# EAGLE design control (EAGLE 8.4.2)
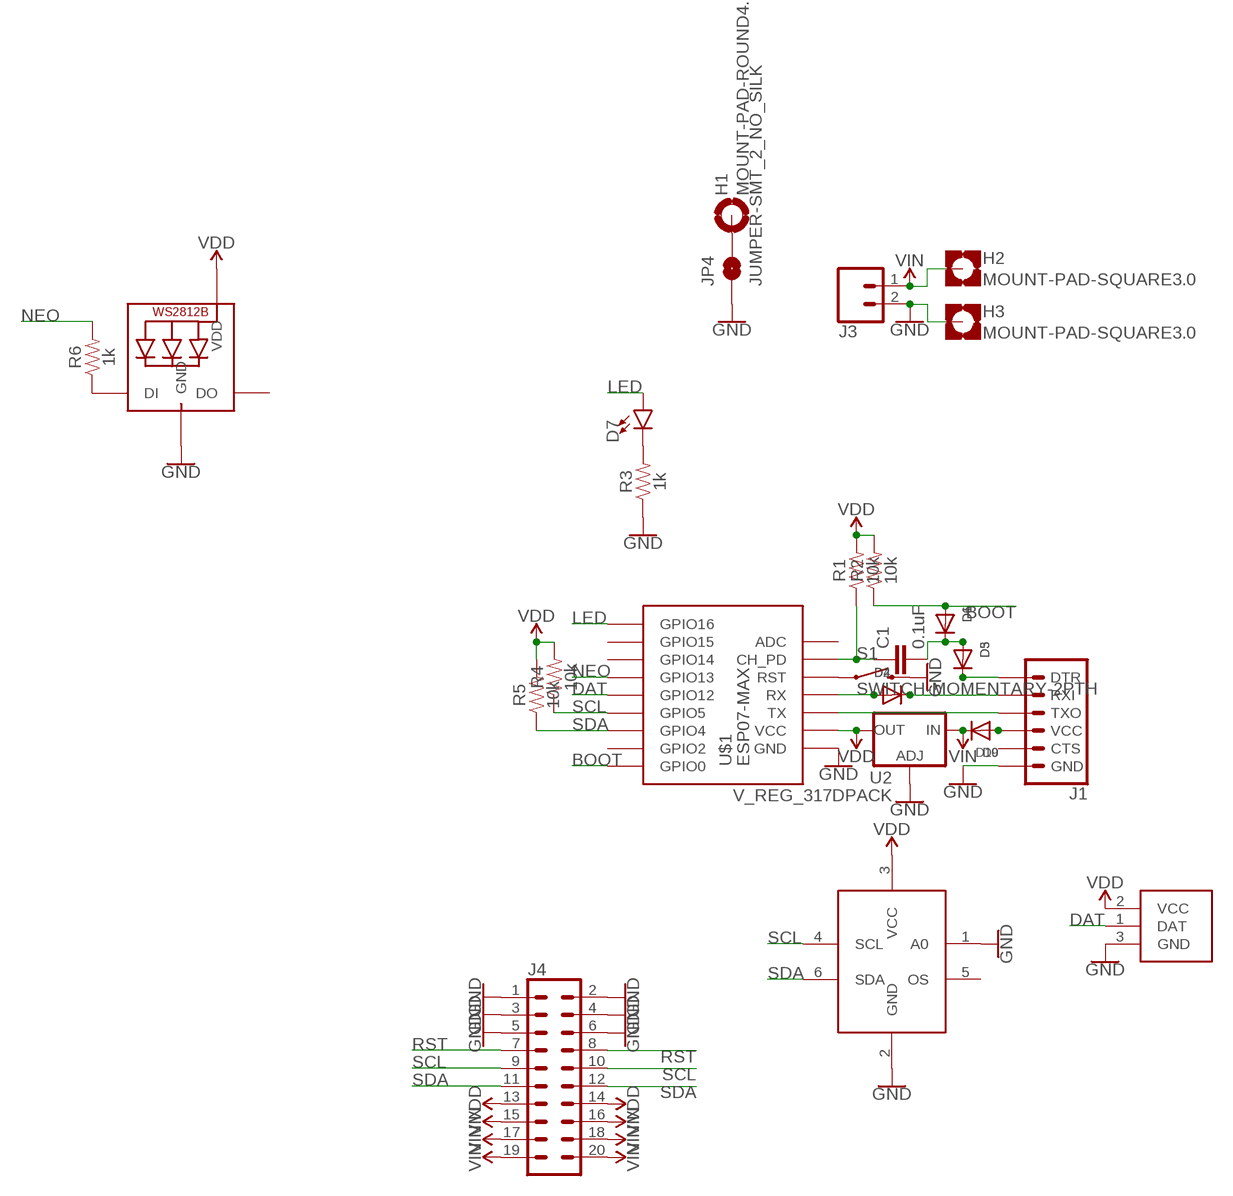
[diagram p0: schematic, sheet 1]

## Parts
C1  0.1uF  0.1UF-0603-25V-5%  [0603]
D1  DIODESOD-123  [SOD-123]
D2  DIODESOD-123  [SOD-123]
D3  DIODESOD-123  [SOD-123]
D4  DIODE_SOD-123FL  [SOD-123FL]
D5  DIODE_SOD-123FL  [SOD-123FL]
D6  DIODE_SOD-123FL  [SOD-123FL]
D7  LED0603  [LED-0603]
D9  DIODESOD-123  [SOD-123]
D10  DIODE_SOD-123FL  [SOD-123FL]
H1  MOUNT-PAD-ROUND4.1  [4,1-PAD]
H2  MOUNT-PAD-SQUARE3.0  [3,0-PAD-SQUARE]
H3  MOUNT-PAD-SQUARE3.0  [3,0-PAD-SQUARE]
J1  6_PIN_SERIAL_TARGETSILK  [6_PIN_SERIAL_TARGET_SIDE_W_SILK]
J3  CONN_025MM  [SCREWTERMINAL-5MM-2]
J4  CONN_10X2  [2X10]
JP4  JUMPER-SMT_2_NO_SILK  [SMT-JUMPER_2_NO_SILK]
LED1  WS2812BCOMBO  [COMBONEO]
R1  10k  10KOHM-0603-1/10W-1%  [0603]
R2  10k  10KOHM-0603-1/10W-1%  [0603]
R3  1k  1KOHM-0603-1/10W-1%  [0603]
R4  10k  10KOHM-0603-1/10W-1%  [0603]
R5  10k  10KOHM-0603-1/10W-1%  [0603]
R6  1k  1KOHM-0603-1/10W-1%  [0603]
S1  SWITCH-MOMENTARY-2PTH  [TACTILE-PTH]
U2  V_REG_317DPACK  [V-REG_DPACK]
U$1  ESP07-MAX  [ESP07-MAX]
U$2  PCT2075GV  [SOT23-6]
U$3  ATSHA204A  [SOT23]

## Nets
BOOT: D1.A D6.A R2.1 U$1.P11(GPIO0)
DAT: U$1.P05(GPIO12) U$3.1(DAT)
GND: H3.B3,0(MOUNT) J1.P$6(GND) J3.2 J4.1 J4.2 J4.3 J4.4 J4.5 J4.6 JP4.1 LED1.VSS1(GND) LED1.VSS2(GND) R3.1 S1.3 S1.4 U2.1(ADJ) U$1.P08(GND) U$2.1(A0) U$2.2(GND) U$3.3(GND)
LED: D7.A U$1.P03(GPIO16)
N$1: H1.B4,1(MOUNT) JP4.2
N$2: C1.1 R1.1 U$1.P02(CH_PD)
N$3: D2.A D4.A U$1.P14(RX)
N$4: J1.P$2(TXO) U$1.P15(TX)
N$5: S1.1 S1.2 U$1.P00(RST)
N$6: LED1.DIN1(DI) LED1.DIN2(DI) R6.1
N$7: D2.C D4.C J1.P$3(RXI)
N$8: D3.C D5.C J1.P$1(DTR)
N$9: D7.C R3.2
N$10: D9.A D10.A J1.P$4(VCC)
N$17: C1.2 D1.C D3.A D5.A D6.C
NEO: R6.2 U$1.P06(GPIO13)
RST: J4.7 J4.8
SCL: J4.9 J4.10 R4.1 U$1.P12(GPIO5) U$2.4(SCL)
SDA: J4.11 J4.12 R5.1 U$1.P13(GPIO4) U$2.6(SDA)
VDD: J4.13 J4.14 LED1.VDD1(VDD) LED1.VDD2(VDD) R1.2 R2.2 R4.2 R5.2 U2.4(OUT) U$1.P07(VCC) U$2.3(VCC) U$3.2(VCC)
VIN: D9.C D10.C H2.B3,0(MOUNT) J3.1 J4.15 J4.16 J4.17 J4.18 J4.19 J4.20 U2.3(IN)
Unconnected: J1.P$5(CTS) LED1.DOUT1(DO) LED1.DOUT2(DO) U$1.P01(ADC) U$1.P04(GPIO14) U$1.P09(GPIO15) U$1.P10(GPIO2) U$2.5(OS)

## Library data of the parts
C1 = SparkFun-Capacitors:0.1UF: 0.1µF ceramic capacitors A capacitor is a passive two-terminal electrical component used to store electrical energy temporarily in an electric field.; PROD_ID: CAP-08604
D1-D6 D9 D10 = adafruit:DIODE: Diode SMADIODE - SMA Surface Mount Package 20V 1A Schottky Diode Digikey: 641-1014-6-ND DO-1N4148 - Through Hole Small Current Diode SOD-123 20V 1 A (.5mV Vf) Schottky Diode - Digikey: MBRX120TPMSCT-ND SOD-323 10V 570mA (.38mV Vf, 3ns) Schottky Diode - Digikey: ZLLS410CT-ND SOD-523 30V 30mA Schottky Diode (RB751S-40TE61) - Digikey: RB751S-40TE61CT-ND SOT23-R/W - SOT23 Package (R = Solder Paste/Reflow Ovens, W = Hand-Soldering) BAT54Film 40V 300mA - Digikey: 497-7162-1-ND
D7 = SparkFun-LED:LED: LED (Generic) Standard schematic elements and footprints for 5mm, 3mm, 1206, and 0603 sized LEDs. Generic LEDs with no color specified.
H1 = holes:MOUNT-PAD-ROUND: MOUNTING PAD, round
H2 H3 = holes:MOUNT-PAD-SQUARE: MOUNTING PAD, square
J1 = SparkFun-Connectors:6_PIN_SERIAL_TARGET: 6-pin header connection for use with the "FTDI BASIC" pinout - TARGET SIDE. Also known as "Arduino Serial Program Header". It is used to mate with our FTDI Basic serial programmers using the Arduino IDE. Note, this device has "TARGET" in the name. It is intended to be used on a design that contains a target micro-controller that you wish to program. The "sister" device, named "CABLE" is inteneded to be used on a design that usually lives on the end of your USB cable and prvides the converter chip (FTDI232 or FTDI231x) to commnicate serial RX/TX. You can populate with some of these: Break Away Headers - Straight <https://www.sparkfun.com/products/116> (PRT-00116) For reference (or to suit your programming needs) check out these designs: SparkFun FTDI Basic Breakout - 5V <https://www.sparkfun.com/products/9716> (DEV-09716) SparkFun FTDI Basic Breakout - 3.3V <https://www.sparkfun.com/products/9873> (DEV-09873) SparkFun FTDI SmartBasic <https://www.sparkfun.com/products/12935> (DEV-12935) SparkFun Beefy 3 - FTDI Basic Breakout <https://www.sparkfun.com/products/13746> (DEV-13746)
J3 = SparkFun-Connectors:CONN_02: Multi connection point. Often used as Generic Header-pin footprint for 0.1 inch spaced/style header connections On any of the 0.1 inch spaced packages, you can populate with these: Break Away Headers - Straight <https://www.sparkfun.com/products/116> (PRT-00116) Break Away Male Headers - Right Angle <https://www.sparkfun.com/products/553> (PRT-00553) Female Headers <https://www.sparkfun.com/products/115> (PRT-00115) Break Away Headers - Machine Pin <https://www.sparkfun.com/products/117> (PRT-00117) Break Away Female Headers - Swiss Machine Pin <https://www.sparkfun.com/products/743> (PRT-00743) For SCREWTERMINALS and SPRING TERMINALS visit here: Screw Terimnals on SparkFun.com <https://www.sparkfun.com/search/results?term=Screw+Terminals> (5mm/3.5mm/2.54mm spacing) This device is also useful as a general connection point to wire up your design to another part of your project. Our various solder wires solder well into these plated through hole pads. Hook-Up Wire - Assortment (Stranded, 22 AWG) <https://www.sparkfun.com/products/11375> (PRT-11375) Hook-Up Wire - Assortment (Solid Core, 22 AWG) <https://www.sparkfun.com/products/11367> (PRT-11367) View the entire wire category on our website here <https://www.sparkfun.com/categories/141> Special notes: Molex polarized connector foot print use with: PRT-08233 with associated crimp pins and housings. 2.54_SCREWTERM for use with PRT-10571. 3.5mm Screw Terminal footprints for PRT-08084 5mm Screw Terminal footprints for use with PRT-08432; SF_SKU: PRT-08432
J4 = SparkFun-Connectors:CONN_10X2: Multi connection point. Often used as Generic Header-pin footprint for 0.1 inch spaced/style header connections On any of the 0.1 inch spaced packages, you can populate with these: Break Away Headers - Straight <https://www.sparkfun.com/products/116> (PRT-00116) Break Away Male Headers - Right Angle <https://www.sparkfun.com/products/553> (PRT-00553) Female Headers <https://www.sparkfun.com/products/115> (PRT-00115) Break Away Headers - Machine Pin <https://www.sparkfun.com/products/117> (PRT-00117) Break Away Female Headers - Swiss Machine Pin <https://www.sparkfun.com/products/743> (PRT-00743) Special note about the "SPECIAL" package: This was SPECIALLY designed to be used with our Graphic LCD Backpack. Be sure you want to use this! It is not only staggered on each line of header holes, but IT IS ALSO offset of the center point of the top and bottom lines by 5 mil. This causes the headers to lock into place on the "standard" footprint on the LCD screen. The extra squares on the tdocu layer are there simply to reference other pins (if you were to actually populate a longer header than ten long - this is what we do with the backpacks).
JP4 = SparkFun-Jumpers:JUMPER-SMT_2_NO: Normally open jumper This jumper has two pads in close proximity to each other. Apply solder to close the connection. Round pads are easier to solder for beginners, but are a lot larger. SparkFun Product that uses the round pads: SparkFun EL Sequencer <https://www.sparkfun.com/products/12781>
LED1 = maxorig:WS2812B
R1 R2 R4 R5 = SparkFun-Resistors:10KOHM: 10kΩ resistor A resistor is a passive two-terminal electrical component that implements electrical resistance as a circuit element. Resistors act to reduce current flow, and, at the same time, act to lower voltage levels within circuits. - Wikipedia; PROD_ID: RES-00824
R3 R6 = SparkFun-Resistors:1KOHM: 1kΩ resistor A resistor is a passive two-terminal electrical component that implements electrical resistance as a circuit element. Resistors act to reduce current flow, and, at the same time, act to lower voltage levels within circuits. - Wikipedia; PROD_ID: RES-07856
S1 = maxorig:SWITCH-MOMENTARY-2: Various NO switches- pushbuttons, reed, etc; PROD_ID: SWCH-08441
U2 = SparkFun-IC-Power:V_REG_317: Voltage Regulator Standard LM317 adjustable voltage regulator. AOI (Adjust Output Input). Google 'LM317 Calculator' for easy to use app to get the two resistor values needed. 240/720 for 5V output. 240/390 for 3.3V output. Spark Fun Electronics SKU : COM-00527; PROD_ID: IC-09888
U$1 = esp8266modules:ESP07-MAX: ESP8266 Wifi module 07 & 08
U$2 = maxorig:PCT2075GV: I2C bus digital temperature sensor and thermal watchdog 2.7-5.5V supply, -55 to +125 C range, 11-bit ADC Can be used as a simple thermostat, pulls OS pin low or high when a high temp is reached, and returns to original state when temp reaches low setpoint. Three devices can be used on the same bus due to unique tri-state address pin, non-TSOP6 versions have 3 address pins for 27 possible addresses.
U$3 = maxorig:ATSHA204A

## Board
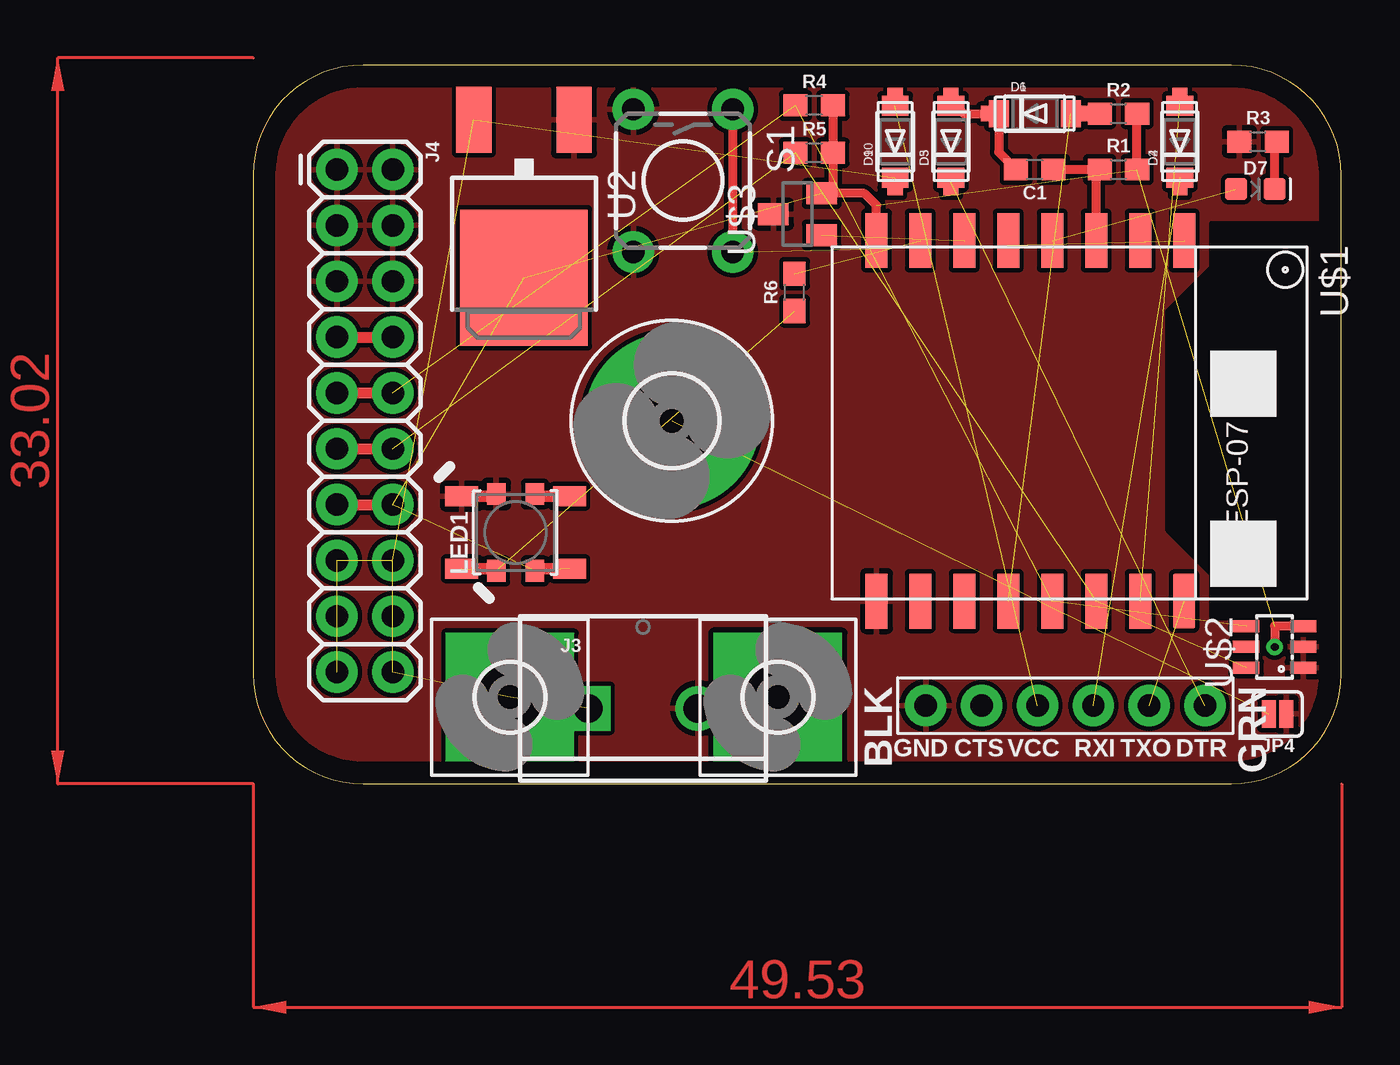
[diagram p1: board, top side]
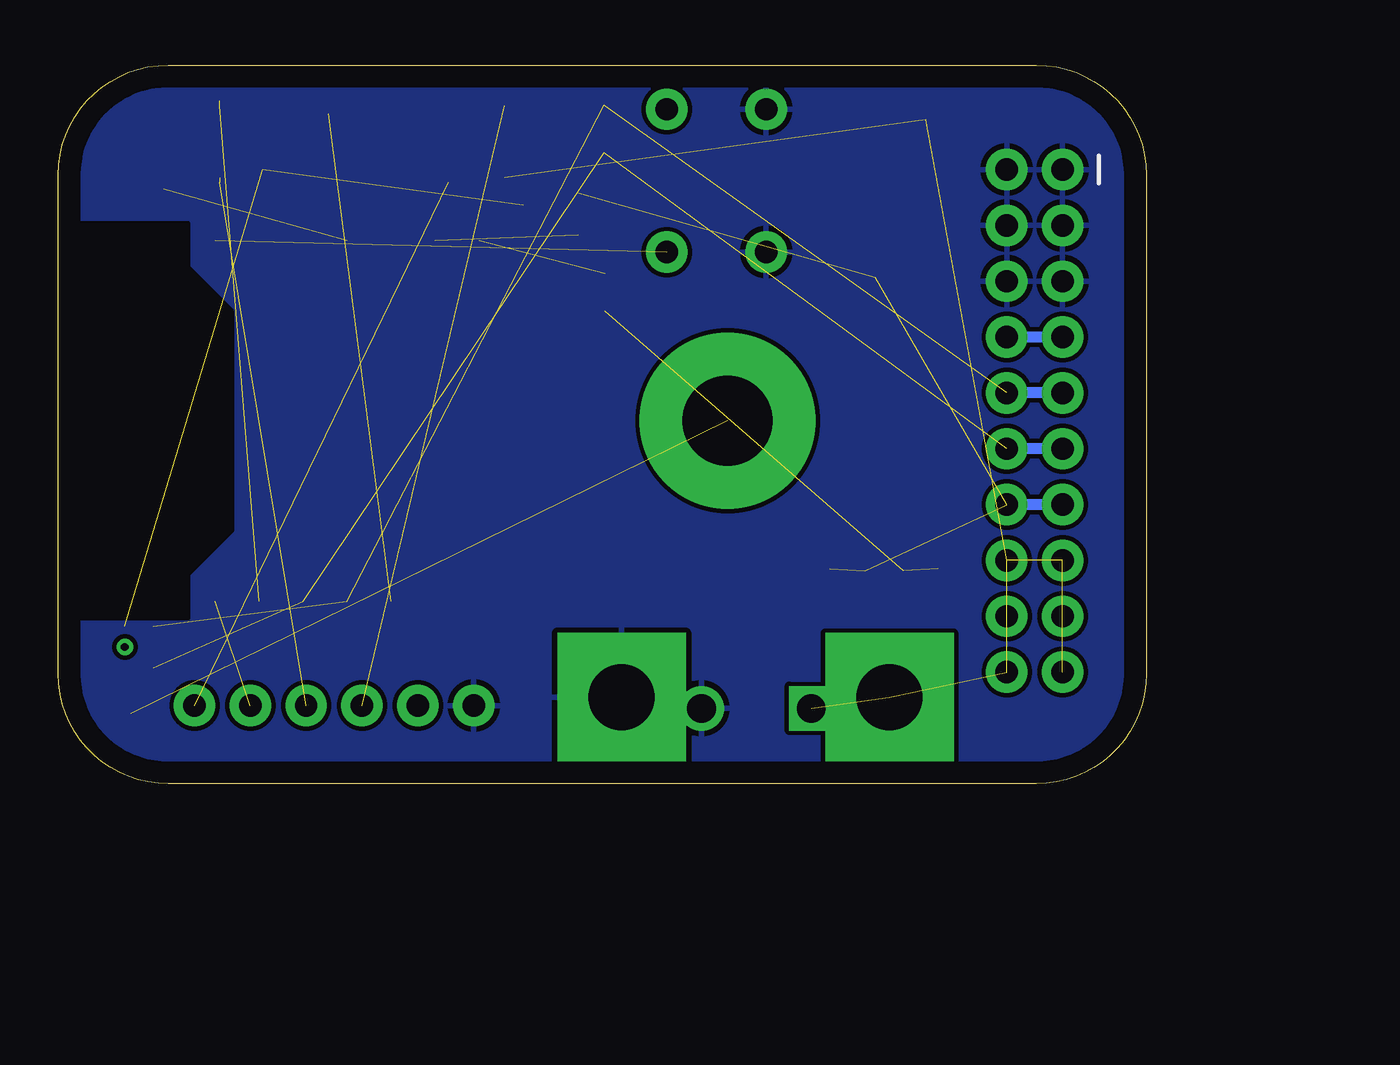
[diagram p2: board, bottom side, seen from below]

Size 49.51 x 32.69 mm. Coordinates in mm from the lower left corner, seen from the top.
Outline: 0,27.69 0,5 arc90 5,0 44.51,0 arc90 49.51,5 49.51,27.69 arc90 44.51,32.69 5,32.69 arc90 0,27.69
Copper layers (1*16): Top 0.035mm / dielectric 1.5mm / Bottom 0.035mm
Design rules "default": minimum track width 10mil, minimum drill 24mil, track to track 8mil, track to pad 8mil, pad to pad 8mil, via to via 8mil, smd to smd 8mil, copper to edge 40mil, drill to drill 8mil, minimum pad ring 10mil, minimum via ring 8mil, stop-mask expansion 4mil, vias tented up to drill 0mil, thermal gap 10mil

### Footprints (pad centres in the part's own frame; a part is rotated, then mirrored left to right if it is on the bottom)
0603 = smd 1.1 x 1: 1 -0.85,0; 2 0.85,0
SOD-123 = smd 1.2 x 0.7: A 1.85,0; C -1.85,0
SOD-123FL = smd 0.91 x 1.22: A 1.637,0; C -1.637,0
LED-0603 = smd 1 x 1: A -0.877,0; C 0.877,0
4,1-PAD = drill 4.1 pad 8: B4,1 0,0
3,0-PAD-SQUARE = drill 3 pad 5.842 square: B3,0 0,0
6_PIN_SERIAL_TARGET_SIDE_W_SILK = drill 1.016 pad 1.88: P$1 -6.35,0; P$2 -3.81,0; P$3 -1.27,0; P$4 1.27,0; P$5 3.81,0; P$6 6.35,0
SCREWTERMINAL-5MM-2 = drill 1.3 pad 2.032 square: 1 0,0 | drill 1.3 pad 2.032: 2 5,0
2X10 = drill 1.016 pad 1.88: 1 0,0; 2 0,2.54; 3 2.54,0; 4 2.54,2.54; 5 5.08,0; 6 5.08,2.54; 7 7.62,0; 8 7.62,2.54; 9 10.16,0; 10 10.16,2.54; 11 12.7,0; 12 12.7,2.54; 13 15.24,0; 14 15.24,2.54; 15 17.78,0; 16 17.78,2.54; 17 20.32,0; 18 20.32,2.54; 19 22.86,0; 20 22.86,2.54
SMT-JUMPER_2_NO_SILK = smd 0.635 x 1.27: 1 -0.406,0; 2 0.406,0
COMBONEO = smd 1 x 0.85: DIN1 -1.75,0.875; DOUT1 1.75,-0.875; VDD1 -1.75,-0.875; VSS1 1.75,0.875 | smd 0.9 x 1.5: DIN2 -1.65,2.45; DOUT2 1.65,-2.45; VDD2 -1.65,-2.45; VSS2 1.65,2.45
TACTILE-PTH = drill 1.016 pad 1.88: 1 -3.251,2.261; 2 3.251,2.261; 3 -3.251,-2.261; 4 3.251,-2.261
V-REG_DPACK = smd 1.6 x 3: 1 -2.28,-4.8; 3 2.28,-4.8 | smd 5.8 x 6.2: 4 0,2.38
ESP07-MAX = smd 2.5 x 1: P00 -8.2,6.8; P01 -8.2,4.8; P02 -8.2,2.8; P03 -8.2,0.8; P04 -8.2,-1.2; P05 -8.2,-3.2; P06 -8.2,-5.2; P07 -8.2,-7.2; P08 8.2,-7.2; P09 8.2,-5.2; P10 8.2,-3.2; P11 8.2,-1.2; P12 8.2,0.8; P13 8.2,2.8; P14 8.2,4.8; P15 8.2,6.8
SOT23-6 = smd 0.55 x 1.2: 1 -0.95,-1.3; 2 0,-1.3; 3 0.95,-1.3; 4 0.95,1.3; 5 0,1.3; 6 -0.95,1.3
SOT23 = smd 1 x 1.4: 1 -0.95,-1.1; 2 0.95,-1.1; 3 0,1.1

### Placement (x,y rotation side)
C1  35.56,27.94 180 top
D1  35.56,30.48 0 top
D2  42.16,29.21 90 top
D3  31.75,29.21 90 top
D4  42.16,29.21 90 top
D5  31.75,29.21 90 top
D6  35.56,30.48 0 top
D7  45.59,27.05 0 top
D9  29.21,29.21 90 top
D10  29.21,29.21 90 top
H1  19.05,16.51 0 top
H2  11.68,3.94 0 top
H3  23.88,3.94 0 top
J1  36.96,3.56 180 top
J3  15.24,3.43 0 top
J4  3.81,27.94 270 top
JP4  46.61,3.17 180 top
LED1  11.94,11.43 90 top
R1  39.37,27.94 0 top
R2  39.37,30.48 0 top
R3  45.72,29.21 0 top
R4  25.53,30.86 0 top
R5  25.53,28.7 0 top
R6  24.64,22.35 90 top
S1  19.56,27.43 270 top
U2  12.32,25.4 180 top
U$1  35.56,16.51 270 top
U$2  46.48,6.22 90 top
U$3  24.77,25.91 90 top

### Tracks (layer width: path | path; a pad name or v marks a point on that pad's centre or on a via)
BOOT  (1 unrouted)
  Top 0.406: R2.1 D6.A D1.A
DAT  (1 unrouted)
GND
  pour Bottom: 0,27.94 arc-90 5.08,33.02 44.45,33.02 arc-90 49.53,27.94 49.53,5.08 arc-90 44.45,0 5.08,0 arc-90 0,5.08
  pour Top: 0,27.94 arc-90 5.08,33.02 44.45,33.02 arc-90 49.53,27.94 49.53,5.08 arc-90 44.45,0 5.08,0 arc-90 0,5.08
LED  (1 unrouted)
N$1  (1 unrouted)
N$2
  Top 0.406: U$1.P02 38.36,27.78 R1.1 C1.1
N$3  (2 unrouted)
N$4  (1 unrouted)
N$5  (1 unrouted)
  Top 0.406: S1.1 S1.2
N$6  (2 unrouted)
N$7  (2 unrouted)
N$8  (1 unrouted)
  Top 0.406: D3.C D5.C
N$9
  Top 0.406: R3.2 46.47,29.11 D7.C
N$10  (1 unrouted)
  Top 0.406: D9.A D10.A
N$17
  Top 0.406: C1.2 33.92,28.73 D6.C | D6.C 32.33,30.48 D3.A D5.A | D1.C D6.C
NEO  (1 unrouted)
RST
  Top 0.508: J4.7 J4.8
  Bottom 0.508: J4.7 J4.8
SCL  (3 unrouted)
  Top 0.508: J4.9 J4.10
  Bottom 0.508: J4.9 J4.10
SDA  (3 unrouted)
  Top 0.508: J4.11 J4.12
  Bottom 0.508: J4.11 J4.12
VDD  (via drill 0.35)  (6 unrouted)
  Top 0.406: R1.2 R2.2 | U$2.3 46.48,7.17 v46.48,6.22 | R4.2 R5.2 26.38,26.85 U$3.2 27.81,26.86 28.36,26.31 U$1.P07
  Top 0.508: J4.13 J4.14
  Bottom 0.508: J4.13 J4.14
VIN  (9 unrouted)
  Top 0.406: D9.C D10.C
(copper drawn outside any net)
  shapes: Top area x2